# Altium project Mạch nguồn.PrjPcb
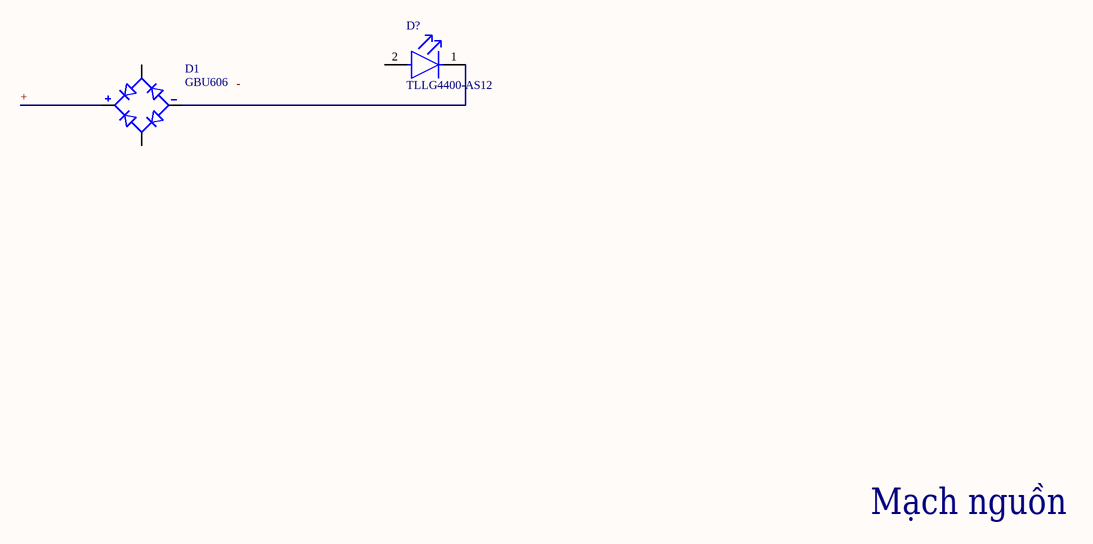
[diagram p0: Sheet1.SchDoc]
1 sheet, 2 parts. Net scope: global (net labels, ports and power ports of the same name join across sheets).
Board file: PCB1.PcbDoc

## Sheet Sheet1.SchDoc
size A4; SheetNumber: 1; SheetTotal: 1

### Parts
D1  GBU606  [SIP343W114P508L2205H2134Q4]
D?  TLLG4400-AS12  [FP-6_544-5255_01-4-MFG]

### Nets
+: D1.POS
NetD1_NEG: D1.NEG D?.1(C)

Not connected (* = marked no-connect by the designer): D1 AC1 AC2; D? 2(A)

### Notes on the sheet
- Mạch nguồn
- Labels drawn without touching a wire or pin: -

### Library data of the parts
D1 = GBU606: 6A 600V Bridge Rectifier Case GBU | Diodes Inc GBU606; MF: Diodes Inc.; SnapEDA_Link: https://www.snapeda.com/parts/GBU606/Diodes+Inc./view-part/?ref=snap; Package: SIP-4 Diodes Incorporated; Value: *; MP: GBU606; Check_prices: https://www.snapeda.com/parts/GBU606/Diodes+Inc./view-part/?ref=eda
D? = CMP-02520-000017-1: LED GREEN DIFFUSED T-1 T/H; Number of Elements: 1; Forward Voltage: 2.4V; Luminous Intensity: 2mcd; Reverse Voltage: 20V; Power Dissipation: 20mW; Dominant Wavelength: 575nm; Forward Current: 7mA; Viewing Angle: 50°; Test Current: 2mA; Number of Pins: 2; Lens Style: Diffused; Color: Green; Case/Package: T; Depth: 3.2mm; Length: 3.2mm; Number of LEDs: 1; Mount: Through Hole; Radiation Hardening: No; Max Operating Temperature: 100°C; RoHS Compliant: No; Min Operating Temperature: -40°C; Packaging: Tape and Reel